# Altium schematic sheet XP1.SchDoc: XP1 Connections
size A; Organization: UCLA High Energy Physics; Address1: L3, 12a Rodborough Rd; Address2: Frenchs Forest; Address3: NSW; Address4: Australia 2086; DocumentNumber: 3; Revision: 2.0; SheetNumber: 3; SheetTotal: 23; CurrentDate: 9/6/2018; ModifiedDate: 9/6/2018; ProjectName: Project
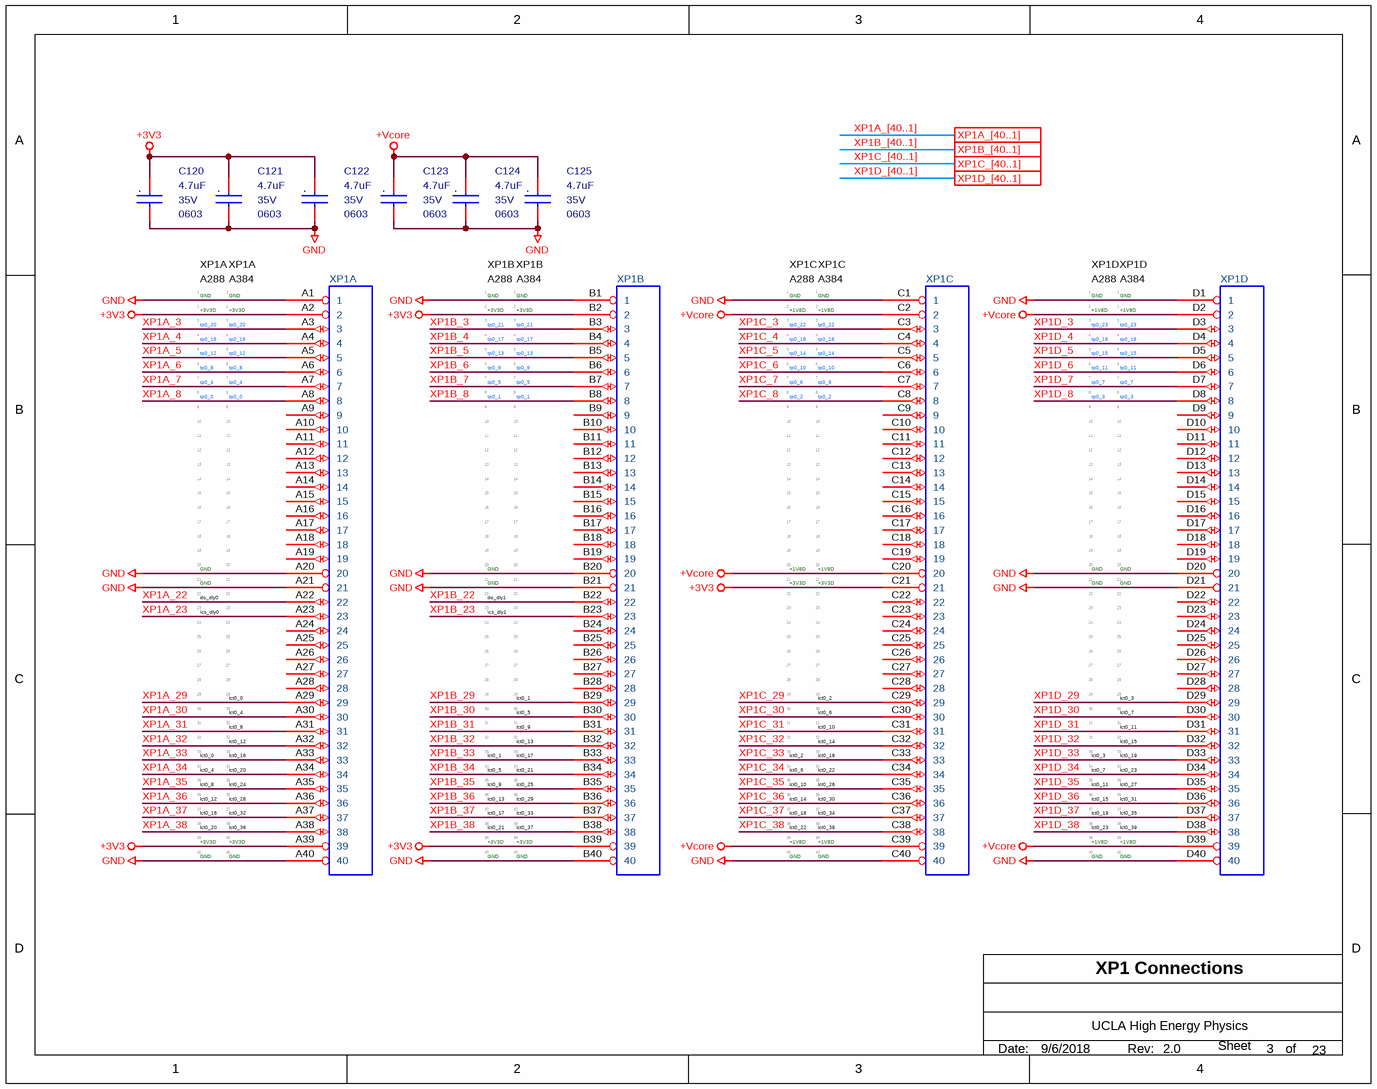
[diagram p0: XP1.SchDoc]

## Parts
(Parts that share a designator on the sheet are numbered #1, #2 ... from top to bottom, then left to right.)
C120  4.7uF  Voltage - Rated: 35V  package: 0603  [MC_S6/SM/C_0603_IPC]
C121  4.7uF  Voltage - Rated: 35V  package: 0603  [MC_S6/SM/C_0603_IPC]
C122  4.7uF  Voltage - Rated: 35V  package: 0603  [MC_S6/SM/C_0603_IPC]
C123  4.7uF  Voltage - Rated: 35V  package: 0603  [MC_S6/SM/C_0603_IPC]
C124  4.7uF  Voltage - Rated: 35V  package: 0603  [MC_S6/SM/C_0603_IPC]
C125  4.7uF  Voltage - Rated: 35V  package: 0603  [MC_S6/SM/C_0603_IPC]
XP1  Samtec_XP1  [MC_S6/TH/SAMTEC_MOLC_40x4]  (value not drawn)  (parts A,B,C,D of 4)
XP?#1  A288_XP1  (value not drawn)  (part A of 4)  (graphical)
XP?#2  A384_XP1  (value not drawn)  (part A of 4)  (graphical)
XP?#3  A288_XP1  (value not drawn)  (part B of 4)  (graphical)
XP?#4  A384_XP1  (value not drawn)  (part B of 4)  (graphical)
XP?#5  A288_XP1  (value not drawn)  (part C of 4)  (graphical)
XP?#6  A384_XP1  (value not drawn)  (part C of 4)  (graphical)
XP?#7  A288_XP1  (value not drawn)  (part D of 4)  (graphical)
XP?#8  A384_XP1  (value not drawn)  (part D of 4)  (graphical)

## Ports
XP1A_[40..1], XP1B_[40..1], XP1C_[40..1], XP1D_[40..1]

## Nets
+3V3: C120.1 C121.1 C122.1 XP1.A2(2) XP1.A39(39) XP1.B2(2) XP1.B39(39) XP1.C21(21)
+Vcore: C123.1 C124.1 C125.1 XP1.C2(2) XP1.C20(20) XP1.C39(39) XP1.D2(2) XP1.D39(39)
GND: C120.2 C121.2 C122.2 C123.2 C124.2 C125.2 XP1.A1(1) XP1.A20(20) XP1.A21(21) XP1.A40(40) XP1.B1(1) XP1.B20(20) XP1.B21(21) XP1.B40(40) XP1.C1(1) XP1.C40(40) XP1.D1(1) XP1.D20(20) XP1.D21(21) XP1.D40(40)
XP1A_3: XP1.A3(3)
XP1A_4: XP1.A4(4)
XP1A_5: XP1.A5(5)
XP1A_6: XP1.A6(6)
XP1A_7: XP1.A7(7)
XP1A_8: XP1.A8(8)
XP1A_22: XP1.A22(22)
XP1A_23: XP1.A23(23)
XP1A_29: XP1.A29(29)
XP1A_30: XP1.A30(30)
XP1A_31: XP1.A31(31)
XP1A_32: XP1.A32(32)
XP1A_33: XP1.A33(33)
XP1A_34: XP1.A34(34)
XP1A_35: XP1.A35(35)
XP1A_36: XP1.A36(36)
XP1A_37: XP1.A37(37)
XP1A_38: XP1.A38(38)
XP1B_3: XP1.B3(3)
XP1B_4: XP1.B4(4)
XP1B_5: XP1.B5(5)
XP1B_6: XP1.B6(6)
XP1B_7: XP1.B7(7)
XP1B_8: XP1.B8(8)
XP1B_22: XP1.B22(22)
XP1B_23: XP1.B23(23)
XP1B_29: XP1.B29(29)
XP1B_30: XP1.B30(30)
XP1B_31: XP1.B31(31)
XP1B_32: XP1.B32(32)
XP1B_33: XP1.B33(33)
XP1B_34: XP1.B34(34)
XP1B_35: XP1.B35(35)
XP1B_36: XP1.B36(36)
XP1B_37: XP1.B37(37)
XP1B_38: XP1.B38(38)
XP1C_3: XP1.C3(3)
XP1C_4: XP1.C4(4)
XP1C_5: XP1.C5(5)
XP1C_6: XP1.C6(6)
XP1C_7: XP1.C7(7)
XP1C_8: XP1.C8(8)
XP1C_29: XP1.C29(29)
XP1C_30: XP1.C30(30)
XP1C_31: XP1.C31(31)
XP1C_32: XP1.C32(32)
XP1C_33: XP1.C33(33)
XP1C_34: XP1.C34(34)
XP1C_35: XP1.C35(35)
XP1C_36: XP1.C36(36)
XP1C_37: XP1.C37(37)
XP1C_38: XP1.C38(38)
XP1D_3: XP1.D3(3)
XP1D_4: XP1.D4(4)
XP1D_5: XP1.D5(5)
XP1D_6: XP1.D6(6)
XP1D_7: XP1.D7(7)
XP1D_8: XP1.D8(8)
XP1D_29: XP1.D29(29)
XP1D_30: XP1.D30(30)
XP1D_31: XP1.D31(31)
XP1D_32: XP1.D32(32)
XP1D_33: XP1.D33(33)
XP1D_34: XP1.D34(34)
XP1D_35: XP1.D35(35)
XP1D_36: XP1.D36(36)
XP1D_37: XP1.D37(37)
XP1D_38: XP1.D38(38)

Not connected (* = marked no-connect by the designer): XP1 A9(9) A10(10) A11(11) A12(12) A13(13) A14(14) A15(15) A16(16) A17(17) A18(18) A19(19) A24(24) A25(25) A26(26) A27(27) A28(28) B9(9) B10(10) B11(11) B12(12) B13(13) B14(14) B15(15) B16(16) B17(17) B18(18) B19(19) B24(24) B25(25) B26(26) B27(27) B28(28) C9(9) C10(10) C11(11) C12(12) C13(13) C14(14) C15(15) C16(16) C17(17) C18(18) C19(19) C22(22) C23(23) C24(24) C25(25) C26(26) C27(27) C28(28) D9(9) D10(10) D11(11) D12(12) D13(13) D14(14) D15(15) D16(16) D17(17) D18(18) D19(19) D22(22) D23(23) D24(24) D25(25) D26(26) D27(27) D28(28)

## Buses and harness runs
bus XP1A_[40..1] = port XP1A_[40..1]
bus XP1B_[40..1] = port XP1B_[40..1]
bus XP1C_[40..1] = port XP1C_[40..1]
bus XP1D_[40..1] = port XP1D_[40..1]

## Notes on the sheet
- Date:
- Rev:
- of
- Sheet
- (in symbol A288_XP1, part A) XP1A; A288; 1; GND; 2; +3V3D; 3; tp0_20; 4; tp0_16; 5; tp0_12; 6; tp0_8; 7; tp0_4; 8; tp0_0; 9; 10; 11; 12; 13; 14; 15; 16; 17; 18; 19; 20; 21; 22; do_dly0; 23; \cs_dly0; 24; 25; 26; 27; 28; 29; 30; 31; 32; 33; lct0_0; 34; lct0_4; 35; lct0_8; 36; lct0_12; 37; lct0_16; 38; lct0_20; 39; 40
- (in symbol A288_XP1, part B) XP1B; A288; 1; GND; 2; +3V3D; 3; tp0_21; 4; tp0_17; 5; tp0_13; 6; tp0_9; 7; tp0_5; 8; tp0_1; 9; 10; 11; 12; 13; 14; 15; 16; 17; 18; 19; 20; 21; 22; do_dly1; 23; \cs_dly1; 24; 25; 26; 27; 28; 29; 30; 31; 32; 33; lct0_1; 34; lct0_5; 35; lct0_9; 36; lct0_13; 37; lct0_17; 38; lct0_21; 39; 40
- (in symbol A288_XP1, part C) XP1C; A288; 1; GND; 2; +1V8D; 3; tp0_22; 4; tp0_18; 5; tp0_14; 6; tp0_10; 7; tp0_6; 8; tp0_2; 9; 10; 11; 12; 13; 14; 15; 16; 17; 18; 19; 20; 21; +3V3D; 22; 23; 24; 25; 26; 27; 28; 29; 30; 31; 32; 33; lct0_2; 34; lct0_6; 35; lct0_10; 36; lct0_14; 37; lct0_18; 38; lct0_22; 39; 40
- (in symbol A288_XP1, part D) XP1D; A288; 1; GND; 2; +1V8D; 3; tp0_23; 4; tp0_19; 5; tp0_15; 6; tp0_11; 7; tp0_7; 8; tp0_3; 9; 10; 11; 12; 13; 14; 15; 16; 17; 18; 19; 20; 21; 22; 23; 24; 25; 26; 27; 28; 29; 30; 31; 32; 33; lct0_3; 34; lct0_7; 35; lct0_11; 36; lct0_15; 37; lct0_19; 38; lct0_23; 39; 40
- (in symbol A384_XP1, part A) XP1A; A384; 1; GND; 2; +3V3D; 3; tp0_20; 4; tp0_16; 5; tp0_12; 6; tp0_8; 7; tp0_4; 8; tp0_0; 9; 10; 11; 12; 13; 14; 15; 16; 17; 18; 19; 20; 21; 22; 23; 24; 25; 26; 27; 28; 29; lct0_0; 30; lct0_4; 31; lct0_8; 32; lct0_12; 33; lct0_16; 34; lct0_20; 35; lct0_24; 36; lct0_28; 37; lct0_32; 38; lct0_36; 39; 40
- (in symbol A384_XP1, part B) XP1B; A384; 1; GND; 2; +3V3D; 3; tp0_21; 4; tp0_17; 5; tp0_13; 6; tp0_9; 7; tp0_5; 8; tp0_1; 9; 10; 11; 12; 13; 14; 15; 16; 17; 18; 19; 20; 21; 22; 23; 24; 25; 26; 27; 28; 29; lct0_1; 30; lct0_5; 31; lct0_9; 32; lct0_13; 33; lct0_17; 34; lct0_21; 35; lct0_25; 36; lct0_29; 37; lct0_33; 38; lct0_37; 39; 40
- (in symbol A384_XP1, part C) XP1C; A384; 1; GND; 2; +1V8D; 3; tp0_22; 4; tp0_18; 5; tp0_14; 6; tp0_10; 7; tp0_6; 8; tp0_2; 9; 10; 11; 12; 13; 14; 15; 16; 17; 18; 19; 20; 21; +3V3D; 22; 23; 24; 25; 26; 27; 28; 29; lct0_2; 30; lct0_6; 31; lct0_10; 32; lct0_14; 33; lct0_18; 34; lct0_22; 35; lct0_26; 36; lct0_30; 37; lct0_34; 38; lct0_38; 39; 40
- (in symbol A384_XP1, part D) XP1D; A384; 1; GND; 2; +1V8D; 3; tp0_23; 4; tp0_19; 5; tp0_15; 6; tp0_11; 7; tp0_7; 8; tp0_3; 9; 10; 11; 12; 13; 14; 15; 16; 17; 18; 19; 20; 21; 22; 23; 24; 25; 26; 27; 28; 29; lct0_3; 30; lct0_7; 31; lct0_11; 32; lct0_15; 33; lct0_19; 34; lct0_23; 35; lct0_27; 36; lct0_31; 37; lct0_35; 38; lct0_39; 39; 40
- (in symbol GRM188R6YA475KE15D) .
- (in symbol Samtec_XP1, part A) XP1A
- (in symbol Samtec_XP1, part B) XP1B
- (in symbol Samtec_XP1, part C) XP1C
- (in symbol Samtec_XP1, part D) XP1D

## Library data of the parts
C120-C125 = GRM188R6YA475KE15D: CAP CER 4.7UF 35V X5R 0603; Manufacturer: Murata; Product Training Modules: High-Cap Multilayer Ceramic Capacitors; Featured Product: GA3 Safety Recognized Capacitors; EDA / CAD Models: Download from Accelerated Designs; Capacitance: 4.7µF; Tolerance: ±10%; Online Catalog: GRM Series; Other Names: 490-7205-2; Supplier 1: Digikey; Manufacturer Part Number: GRM188R6YA475KE15D; Stock 1: 180441; Pricing 1: 1=0.32, 10=0.264, 50=0.1486, 100=0.132, 250=0.099, 500=0.0875, 1000=0.0776 (USD); Standard Package: 4,000; Category: Capacitors; Family: Ceramic Capacitors; Series: GRM; Packaging: Tape & Reel (TR); Temperature Coefficient: X5R; Mounting Type: Surface Mount, MLCC; Operating Temperature: -55°C ~ 85°C; Applications: General Purpose; Package / Case: 0603 (1608 Metric); Size / Dimension: 0.063" L x 0.031" W (1.60mm x 0.80mm); Thickness (Max): 0.031" (0.80mm); ComponentLink1URL: https://datasheet.ciiva.com/46444/1769893-46444984.pdf; ComponentLink1Description: https://datasheet.ciiva.com/46444/1769893-46444984.pdf; ComponentLink2URL: https://datasheet.ciiva.com/46444/1769893-46444985.pdf; ComponentLink2Description: https://datasheet.ciiva.com/46444/1769893-46444985.pdf; ComponentLink3URL: https://datasheet.ciiva.com/14906/partnumbering-e-01-14906426.pdf; ComponentLink3Description: https://datasheet.ciiva.com/14906/partnumbering-e-01-14906426.pdf; ComponentLink4URL: https://datasheet.ciiva.com/14906/partnumbering-e-01-14906427.pdf; ComponentLink4Description: https://datasheet.ciiva.com/14906/partnumbering-e-01-14906427.pdf; ComponentLink5URL: https://datasheet.ciiva.com/14906/partnumbering-e-01-14906428.pdf; ComponentLink5Description: https://datasheet.ciiva.com/14906/partnumbering-e-01-14906428.pdf; Supplier 2: Digikey; Stock 2: 180441; Pricing 2: 1=0.32, 10=0.264, 50=0.1486, 100=0.132, 250=0.099, 500=0.0875, 1000=0.0776 (USD); Supplier Part Number 1: 490-7205-1-ND; Supplier Part Number 2: 490-7205-6-ND
XP1 = Samtec_XP1: Manufacturer Part Number: MOLC-140-01-L-Q-LC; mfgr_id: MOLC-140-01-S-Q-LC; mfgr: Samtec; mfgr_foot: 40x4; COMPROT: 180; COMPGROUP: 0; COMPSIDE: TOP; Contact Termination Type: Through Hole; Gender: Header; No. of Contacts: 160; No. of Rows: 4; Pitch Spacing: 1.27; Product Range: MOLC Series; SVHC: No SVHC (12-Jan-2017; Package: XP1; ComponentLink1Description: http://www.farnell.com/cad/2261282.pdf; ComponentLink1URL: http://www.farnell.com/cad/2261282.pdf; ComponentLink2Description: http://www.farnell.com/datasheets/2261038.pdf; ComponentLink2URL: http://www.farnell.com/datasheets/2261038.pdf; Contact Material: Phosphor Bronze; Contact Plating: Gold Plated Contacts; Manufacturer: SAMTEC; Pricing 1: 1=18.16, 3=17.11, 5=16.18, 10=15.35, 15=14.96, 25=14.34 (GBP); RoHS: YES; Stock 1: 0; Supplier 1: Farnell; Supplier Part Number 1: 2732055
XP?#1 XP?#3 XP?#5 XP?#7 = A288_XP1: mfgr_id: MOLC-140-01-S-Q-LC; mfgr: Samtec; mfgr_foot: 40x4; COMPROT: 180; COMPGROUP: 0; COMPSIDE: TOP; Package: XP1
XP?#2 XP?#4 XP?#6 XP?#8 = A384_XP1: mfgr_id: MOLC-140-01-S-Q-LC; mfgr: Samtec; mfgr_foot: 40x4; COMPROT: 180; COMPGROUP: 0; COMPSIDE: TOP; Package: XP1